# EAGLE schematic 555 (EAGLE 6.5.0)
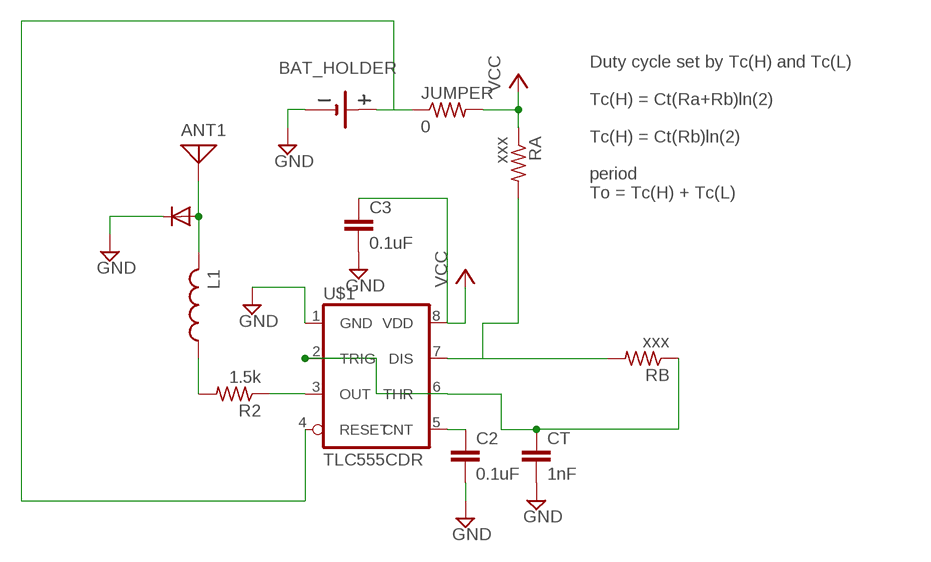
[diagram p0: schematic, sheet 1]

## Parts
ANT1  ANTENNA  [PAD-01]
C2  0.1uF  C-EU050-024X044  [C050-024X044]
C3  0.1uF  C-EU050-024X044  [C050-024X044]
CT  1nF  C-EU050-024X044  [C050-024X044]
JUMPER  0  R-US_M1206  [M1206]
L1  L-USL2012C  [L2012C]
R2  1.5k  R-US_M1206  [M1206]
RA  xxx  R-US_M1206  [M1206]
RB  xxx  R-US_M1206  [M1206]
U$1  TLC555CDR  [TLC555CRD]
U$2  BAT_HOLDER  [BAT_HOLDER]
U$3  BAT-15-03W  [BAT-15-03W]

## Nets
GND: C2.2 C3.2 CT.2 U$1.1(GND) U$2.P_G2(-) U$2.P_G3(-) U$2.P_GND(-) U$3.C
N$1: RA.2 RB.2 U$1.7(DIS)
N$2: R2.1 U$1.3(OUT)
N$3: JUMPER.1 U$1.4(RESET) U$2.P_+(+)
N$4: CT.1 RB.1 U$1.2(TRIG) U$1.6(THR)
N$7: C2.1 U$1.5(CNT)
N$8: L1.1 R2.2
N$9: ANT1.1 L1.2 U$3.A
VCC: C3.1 JUMPER.2 RA.1 U$1.8(VDD)
Unconnected: U$2.NC

## Notes on the sheet
- Duty cycle set by Tc(H) and Tc(L)
  
  Tc(H) = Ct(Ra+Rb)ln(2)
  
  Tc(H) = Ct(Rb)ln(2)
  
  period
  To = Tc(H) + Tc(L)

## Library data of the parts
ANT1 = discrete:ANTENNA: Antenna
C2 C3 CT = resistor:C-EU: CAPACITOR, European symbol
JUMPER R2 RA RB = rcl:R-US_: RESISTOR, American symbol
L1 = resistor:L-US: INDUCTOR, American symbol
U$1 = ece510_library:TLC555CDR
U$2 = ece510_library:BAT_HOLDER
U$3 = ece510_library:BAT-15-03W